# EAGLE schematic untitled (EAGLE 8.4.1)
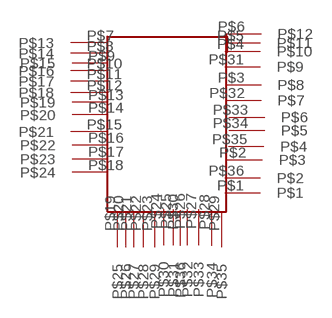
[diagram p0: schematic, sheet 1]

## Parts
U$1  NRFMODULE  [MODULE2]
Unconnected: U$1.P$1 U$1.P$2 U$1.P$3 U$1.P$4 U$1.P$5 U$1.P$6 U$1.P$7 U$1.P$8 U$1.P$9 U$1.P$10 U$1.P$11 U$1.P$12 U$1.P$13 U$1.P$14 U$1.P$15 U$1.P$16 U$1.P$17 U$1.P$18 U$1.P$19 U$1.P$20 U$1.P$21 U$1.P$22 U$1.P$23 U$1.P$24 U$1.P$25 U$1.P$26 U$1.P$27 U$1.P$28 U$1.P$29 U$1.P$30 U$1.P$31 U$1.P$32 U$1.P$33 U$1.P$34 U$1.P$35 U$1.P$36

## Library data of the parts
U$1 = blemoulde:NRFMODULE